# Altium schematic sheet WiFi.SchDoc
size A4; DocumentNumber: 1; SheetNumber: 4
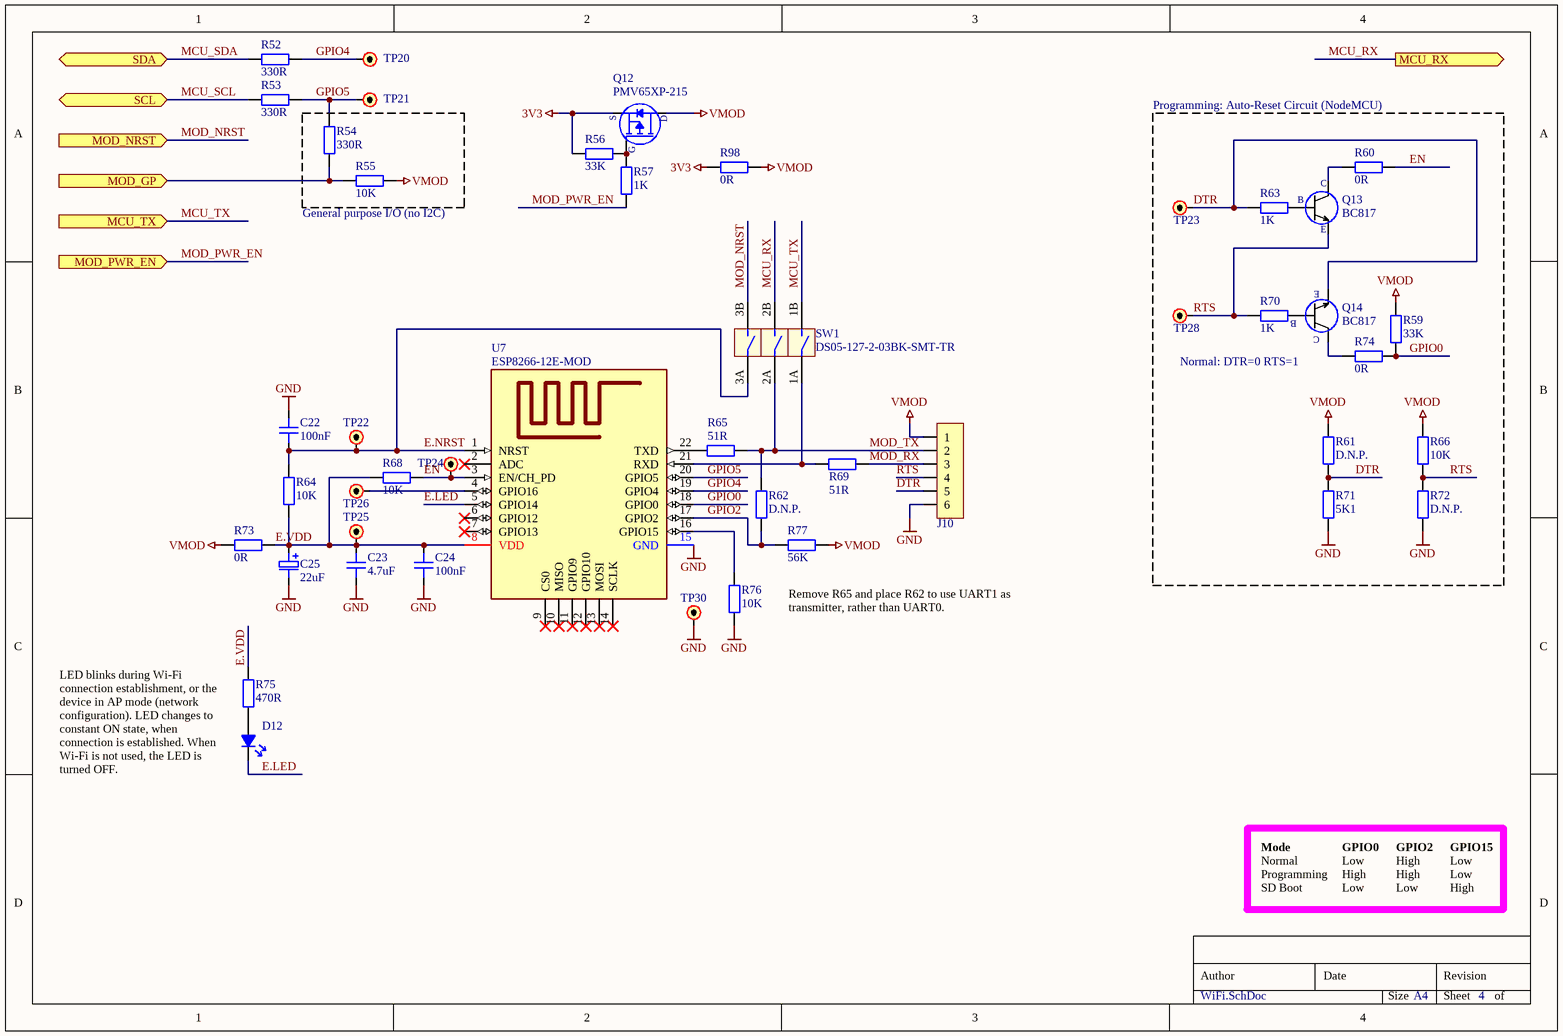
[diagram p0: WiFi.SchDoc]

## Parts
C22  100nF  [0805C_RF_M]
C23  4.7uF  [0805C_RF_M]
C24  100nF  [0805C_RF_M]
C25  22uF  [C_EL_B_4MM_RF_M]
D12  Unspecified  [1206LED_RF_M]  (value not drawn)
J10  PINHDR-6P1  [HEADER-2.54-6P1]  (value not drawn)
Q12  PMV65XP-215  [IRLML_SOT-23]
Q13  BC817  [NXP_SOT-23_RF_M]
Q14  BC817  [NXP_SOT-23_RF_M]
R52  330R  [0805R_RF_M]
R53  330R  [0805R_RF_M]
R54  330R  [0805R_RF_M]
R55  10K  [0805R_RF_M]
R56  33K  [0805R_RF_M]
R57  1K  [0805R_RF_M]
R59  33K  [0805R_RF_M]
R60  0R  [0805R_RF_M]
R61  D.N.P.  [0805R_RF_M]
R62  D.N.P.  [0805R_RF_M]
R63  1K  [0805R_RF_M]
R64  10K  [0805R_RF_M]
R65  51R  [0805R_RF_M]
R66  10K  [0805R_RF_M]
R68  10K  [0805R_RF_M]
R69  51R  [0805R_RF_M]
R70  1K  [0805R_RF_M]
R71  5K1  [0805R_RF_M]
R72  D.N.P.  [0805R_RF_M]
R73  0R  [0805R_RF_M]
R74  0R  [0805R_RF_M]
R75  470R  [0805R_RF_M]
R76  10K  [0805R_RF_M]
R77  56K  [0805R_RF_M]
R98  0R  [0805R_RF_M]
SW1  DS05-127-2-03BK-SMT-TR  [DIP_SWITCH_3POS_1.27mm]
TP20  G.4  [PAD_R_1MM]  (value not drawn)
TP21  G.5  [PAD_R_1MM]  (value not drawn)
TP22  NRST  [PAD_R_1MM]  (value not drawn)
TP23  DTR  [PAD_R_1MM]  (value not drawn)
TP24  CH_PD  [PAD_R_1MM]  (value not drawn)
TP25  E.VDD  [PAD_R_1.5MM]  (value not drawn)
TP26  WAKE  [PAD_R_1MM]  (value not drawn)
TP28  RTS  [PAD_R_1MM]  (value not drawn)
TP30  GND  [PAD_R_1.5MM]  (value not drawn)
U7  ESP8266-12E-MOD  [ESP8266-12E-NBP-MOD]

## Ports
MCU_RX (out), MCU_TX (in), MOD_GP (in), MOD_NRST (in), MOD_PWR_EN (in), SCL (bidir), SDA (bidir)

## Nets
3V3: Q12.2(Source) R56.1 R98.2
GND: C22.1 C23.1 C24.1 C25.N J10.6 R71.2 R72.2 R76.1 TP30.1 U7.15(GND)
VMOD: J10.1 Q12.3(Drain) R55.2 R59.2 R61.1 R66.1 R73.2 R77.1 R98.1
DTR: J10.5 Q14.2(Emmiter) R61.2 R63.1 R71.1 TP23.1
E.LED: D12.C U7.5(GPIO14)
E.NRST: C22.2 R64.1 SW1.3A TP22.1 U7.1(NRST)
E.VDD: C23.2 C24.2 C25.P R64.2 R68.1 R73.1 R75.1 TP25.1 U7.8(VDD)
EN: R60.2 R68.2 TP24.1 U7.3(EN/CH_PD)
GPIO0: R59.1 R74.2 U7.18(GPIO0)
GPIO2: R62.1 R77.2 U7.17(GPIO2)
GPIO4: R52.2 TP20.1 U7.19(GPIO4)
GPIO5: R53.2 R54.2 TP21.1 U7.20(GPIO5)
MCU_RX: SW1.2B ; port MCU_RX
MCU_SCL: R53.1 ; port SCL
MCU_SDA: R52.1 ; port SDA
MCU_TX: SW1.1B ; port MCU_TX
MOD_GP: R54.1 R55.1 ; port MOD_GP
MOD_NRST: SW1.3B ; port MOD_NRST
MOD_PWR_EN: R57.1 ; port MOD_PWR_EN
MOD_RX: J10.3 R69.2
MOD_TX: J10.2 R62.2 R65.2 SW1.2A
RTS: J10.4 Q13.2(Emmiter) R66.2 R70.1 R72.1 TP28.1
NetD12_A: D12.A R75.2
NetQ12_1: Q12.1(Gate) R56.2 R57.2
NetQ13_1: Q13.1(Base) R63.2
NetQ13_3: Q13.3(Collector) R60.1
NetQ14_1: Q14.1(Base) R70.2
NetQ14_3: Q14.3(Collector) R74.1
NetR65_1: R65.1 U7.22(TXD)
NetR69_1: R69.1 SW1.1A U7.21(RXD)
NetR76_2: R76.2 U7.16(GPIO15)
NetTP26_1: TP26.1 U7.4(GPIO16)

Not connected (* = marked no-connect by the designer): U7 2(ADC)* 6(GPIO12)* 7(GPIO13)* 9(CS0)* 10(MISO)* 11(GPIO9)* 12(GPIO10)* 13(MOSI)* 14(SCLK)*

## Notes on the sheet
- Programming: Auto-Reset Circuit (NodeMCU)
- (near R55) General purpose I/O (no I2C)
- Normal: DTR=0 RTS=1
- Remove R65 and place R62 to use UART1 as transmitter, rather than UART0.
- LED blinks during Wi-Fi connection establishment, or the device in AP mode (network configuration). LED changes to constant ON state, when connection is established. When Wi-Fi is not used, the LED is turned OFF.
- Mode
- GPIO0
- GPIO2
- GPIO15
- Normal
- Programming
- SD Boot
- Low
- High
- Author
- Date
- Revision
- Size
- A4
- Sheet
- of
- (in symbol BC817-40-215) C; B; E
- (in symbol PMV65XP-215) S; D; G

## Library data of the parts
C22-C24 = C: Capacitor; Manufacturer: Generic Brand; Max Voltage: ? V; Tolerance: ?; Mounting Technology: SMT; Tag: *; Manufacturer Part No: *; Supplier: *; Supplier Link: http://; Supplier Part No: *; Category: Capacitor
  C22 C24: Value: 100nF
  C23: Value: 4.7uF
C25 = C-P: Polarized Capacitor; Manufacturer: Generic Brand; Max Voltage: ? V; Value: 22uF; Mounting Technology: SMT; Tolerance: ?; Tag: *; Manufacturer Part No: *; Supplier: *; Supplier Link: http://; Supplier Part No: *; Category: Capacitor
D12 = LED: Manufacturer: Generic Brand; Forward Voltage Drop: ? V; Emitting Color: Unspecified; Manufacturer Part No: *; Supplier: *; Supplier Link: http://; Supplier Part No: *; Category: Diode; Mounting Technology: SMT
J10 = PINHDR-6P1: Pin Header Single Row 6 Positions; Mounting Technology: THT
Q12 = PMV65XP-215: MOSFET P-CH 20V 2.8A 23SOT; Gate-Source Threshold Voltage: -0.69V (typ.); Drain-Source Breakdown Voltage: -20V; Drain Current: -2.8A (max.); Max Gate-Source Voltage: 12V (abs.); Supplier Part No: 1727-3124-1-ND; Supplier: DigiKey; Supplier Link: https://www.digikey.com/en/products/detail/nexperia-usa-inc/PMV65XP-215/949643; Mounting Technology: SMT; Package: SOT-23; Alternative Supplier: Chipdip; Alternative Supplier Link: https://www.chipdip.by/product/pmv65xp.215; Alternative Supplier Part No: 9000037397
Q13 Q14 = BC817-40-215: TRANS NPN 45V 0.5A SOT23; Manufacturer: Nexperia USA Inc.; Manufacturer Part No: BC817-40,215; Collector Current: 500 mA; Collector-Emitter Breakdown Voltage: 45V (max.); Power Dissipation: 250 mW; DC Current Gain: 250 @ 100mA, 1V; Supplier: DigiKey; Supplier Link: https://www.digikey.com/en/products/detail/nexperia-usa-inc/BC817-40-215/763235; Supplier Part No: 1727-2919-1-ND; Mounting Technology: SMT; Category: Transistor/BJT; Alternative Supplier: Chipdip; Alternative Supplier Link: https://www.chipdip.by/product/bc817-40; Alternative Supplier Part No: 28806907; Datasheet Link: https://assets.nexperia.com/documents/data-sheet/BC817_SER.pdf; Package: SOT-23
R52-R57 R59-R66 R68-R77 R98 = R: Resistor; Manufacturer: Generic Brand; Power Rating: ? W; Max Voltage: ? V; Tolerance: ?; Supplier Link: http://; Category: Resistor; Mounting Technology: SMT
  R52-R54: Value: 330R
  R55 R64 R66 R68 R76: Value: 10K
  R56 R59: Value: 33K
  R57 R63 R70: Value: 1K
  R60 R73 R74 R98: Value: 0R
  R61 R62 R72: Value: D.N.P.
  R65 R69: Value: 51R
  R71: Value: 5K1
  R75: Value: 470R
  R77: Value: 56K
SW1 = DS05-127-2-03BK-SMT-TR: DIP SWITCH SPST 1.27 PITCH FL 3POS; Supplier: DigiKey; Supplier Part No: DS05-127-2-03BK-SMT-TR; Supplier Link: https://www.digikey.com/en/products/detail/cui-devices/DS05-127-2-03BK-SMT-TR/11310956
TP20-TP26 TP28 TP30 = Test Point: Test Point / Pad
U7 = ESP8266-12E-MOD: RX TXRX MOD WIFI TRACE ANT SMD; Manufacturer: Adafruit Industries LLC; Mounting Technology: SMT; Supplier: DigiKey; Supplier Part No: 1528-1438-ND; Supplier Link: https://www.digikey.com/en/products/detail/adafruit-industries-llc/2491/5761206; Package: Module